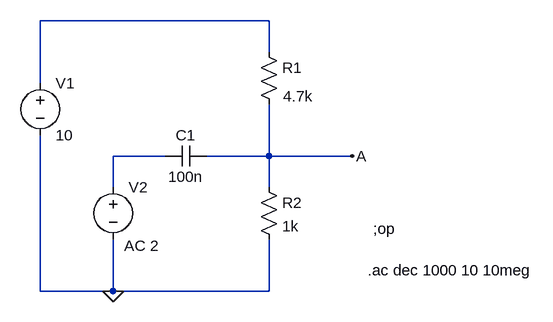
[diagram p0: schematic p4_trabajo previo.asc]
p4_trabajo previo.asc, the LTspice schematic file:
Version 4
SHEET 1 880 680
WIRE 368 -64 16 -64
WIRE 368 -16 368 -64
WIRE 16 32 16 -64
WIRE 208 144 128 144
WIRE 368 144 368 64
WIRE 368 144 272 144
WIRE 496 144 368 144
WIRE 128 192 128 144
WIRE 368 192 368 144
WIRE 16 352 16 112
WIRE 128 352 128 272
WIRE 128 352 16 352
WIRE 368 352 368 272
WIRE 368 352 128 352
FLAG 128 352 0
FLAG 496 144 A
SYMBOL cap 272 128 R90
WINDOW 0 0 32 VBottom 2
WINDOW 3 32 32 VTop 2
SYMATTR InstName C1
SYMATTR Value 100n
SYMBOL res 352 -32 R0
WINDOW 3 38 84 Left 2
SYMATTR InstName R1
SYMATTR Value 4.7k
SYMBOL res 352 176 R0
SYMATTR InstName R2
SYMATTR Value 1k
SYMBOL voltage 16 16 R0
WINDOW 123 0 0 Left 0
WINDOW 39 0 0 Left 0
SYMATTR InstName V1
SYMATTR Value 10
SYMBOL voltage 128 176 R0
WINDOW 3 24 152 Left 2
WINDOW 123 17 106 Left 2
WINDOW 39 0 0 Left 0
SYMATTR InstName V2
SYMATTR Value ""
SYMATTR Value2 AC 2
TEXT 528 256 Left 2 !;op
TEXT 520 320 Left 2 !.ac dec 1000 10 10meg

The netlist it stands for:
* p4_trabajo previo.asc
C1 A N002 100n
R1 N001 A 4.7k
R2 A 0 1k
V1 N001 0 10
V2 N002 0 AC 2
;op
.ac dec 1000 10 10meg
.backanno
.end